# EAGLE design nrf24 leonardo prototype (EAGLE 7.1.0)
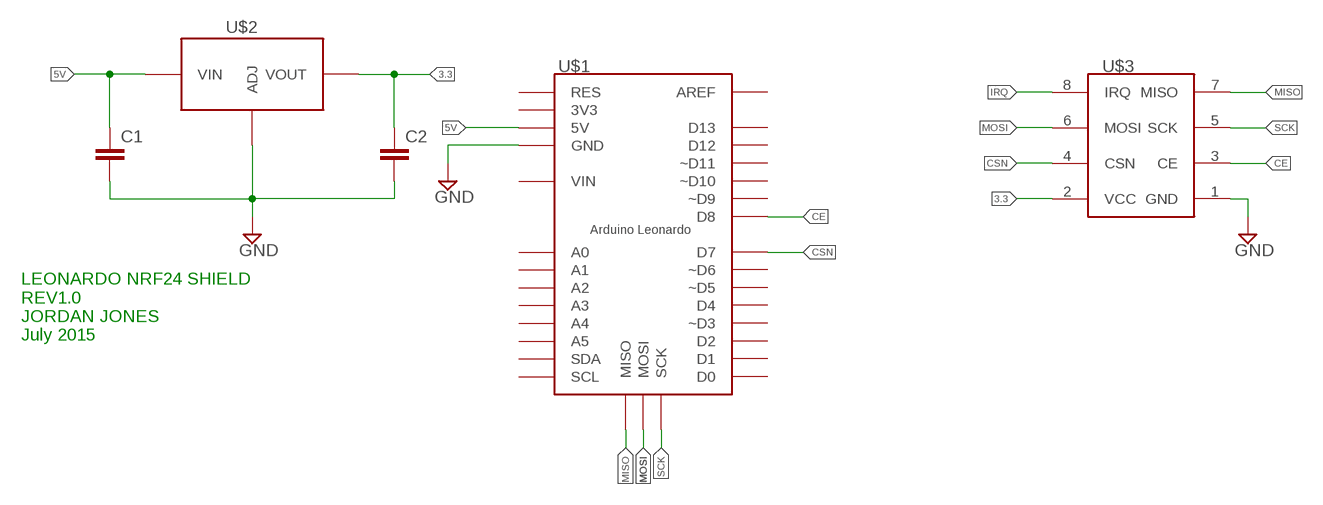
[diagram p0: schematic, sheet 1]

## Parts
C1  CAP0603-CAP  [0603-CAP]
C2  CAP0603-CAP  [0603-CAP]
U$1  LEONARDOSHIELDLEONARDO  [ARDUINOSHIELDR3ISP]
U$2  LM1117  [SOT223]
U$3  NRF24L01  [NRF24L01]

## Nets
3.3: C2.1 U$2.P2(VOUT) U$2.P4(VOUT) U$3.2(VCC)
5V: C1.1 U$1.5V1(5V) U$1.5V2(5V) U$2.P3(VIN)
CE: U$1.D8 U$3.3(CE)
CSN: U$1.D7 U$3.4(CSN)
GND: C1.2 C2.2 U$1.GND1(GND) U$1.GND2(GND) U$1.GND3(GND) U$1.GND4(GND) U$2.P1(ADJ) U$3.1(GND)
IRQ: U$3.8(IRQ)
MISO: U$1.MISO U$3.7(MISO)
MOSI: U$1.MOSI U$3.6(MOSI)
SCK: U$1.SCK U$3.5(SCK)
Unconnected: U$1.3.3V(3V3) U$1.A0 U$1.A1 U$1.A2 U$1.A3 U$1.A4 U$1.A5 U$1.AREF U$1.D0 U$1.D1 U$1.D2 U$1.D3(~D3) U$1.D4 U$1.D5(~D5) U$1.D6(~D6) U$1.D9(~D9) U$1.D10(~D10) U$1.D11(~D11) U$1.D12 U$1.D13 U$1.RES U$1.RES2(RES) U$1.SCL U$1.SDA U$1.VIN

## Notes on the sheet
- LEONARDO NRF24 SHIELD
  REV1.0
  JORDAN JONES
  July 2015

## Library data of the parts
C1 C2 = SparkFun-Capacitors:CAP: Capacitor Standard 0603 ceramic capacitor, and 0.1" leaded capacitor.
U$1 = Jordan Boards:LEONARDOSHIELD
U$2 = Jordan ICs:LM1117: LM1117 5vEd A linear voltage regulator set to 5volts. Max output is 800ma
U$3 = Jordan Boards:NRF24L01: REMEMBER THIS SHIT IS 3.3V MAX!

## Board
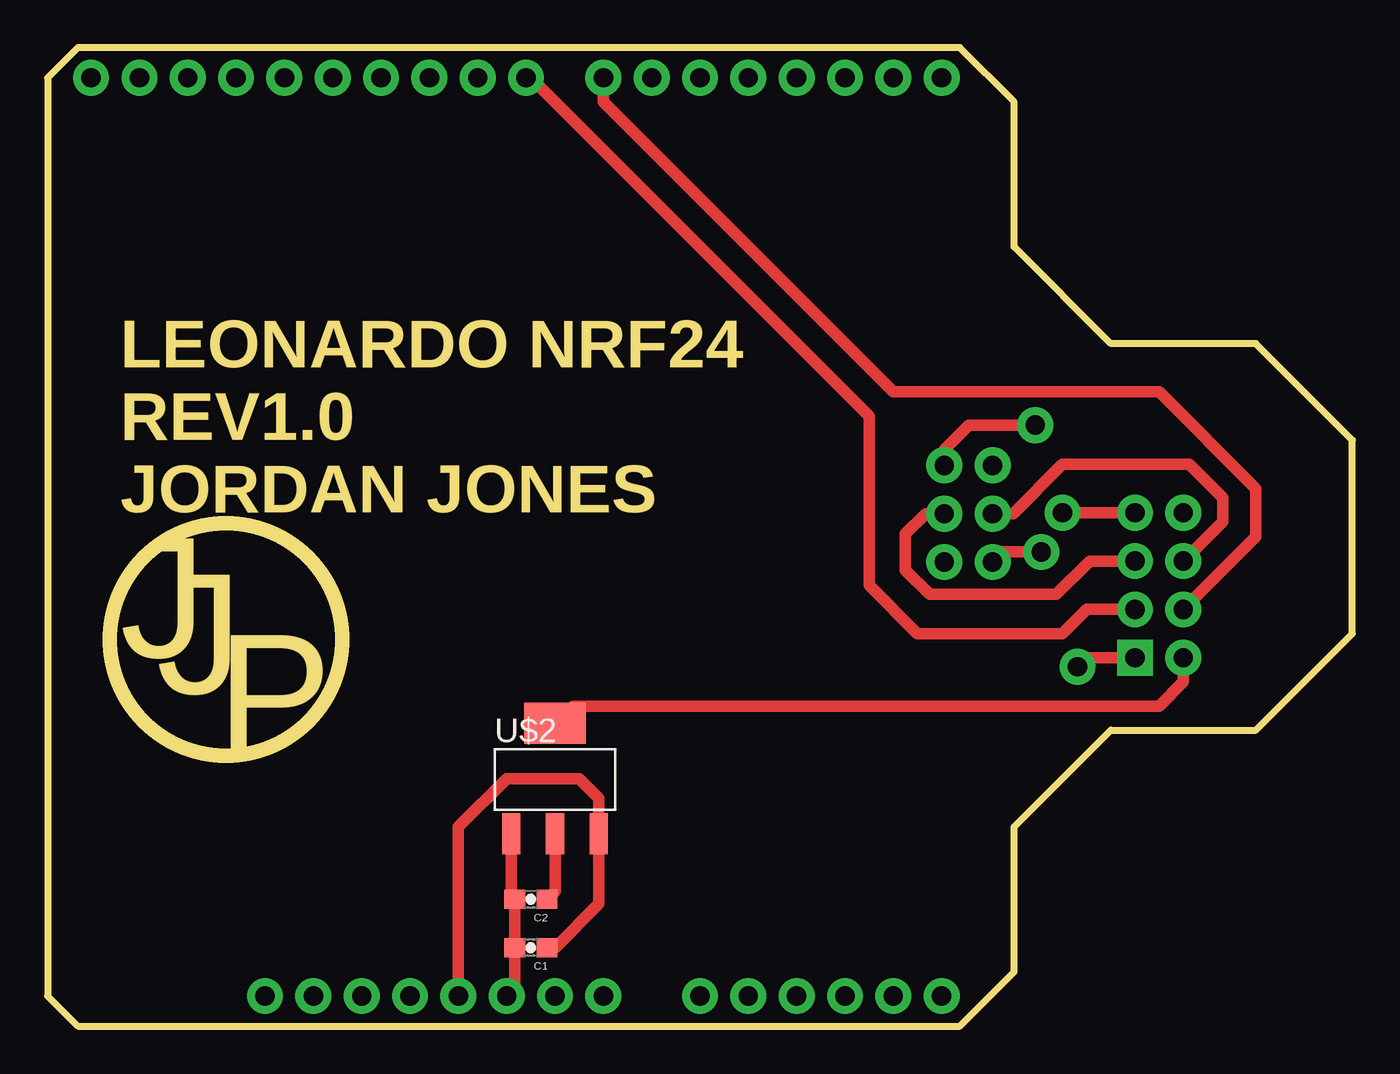
[diagram p1: board, top side]
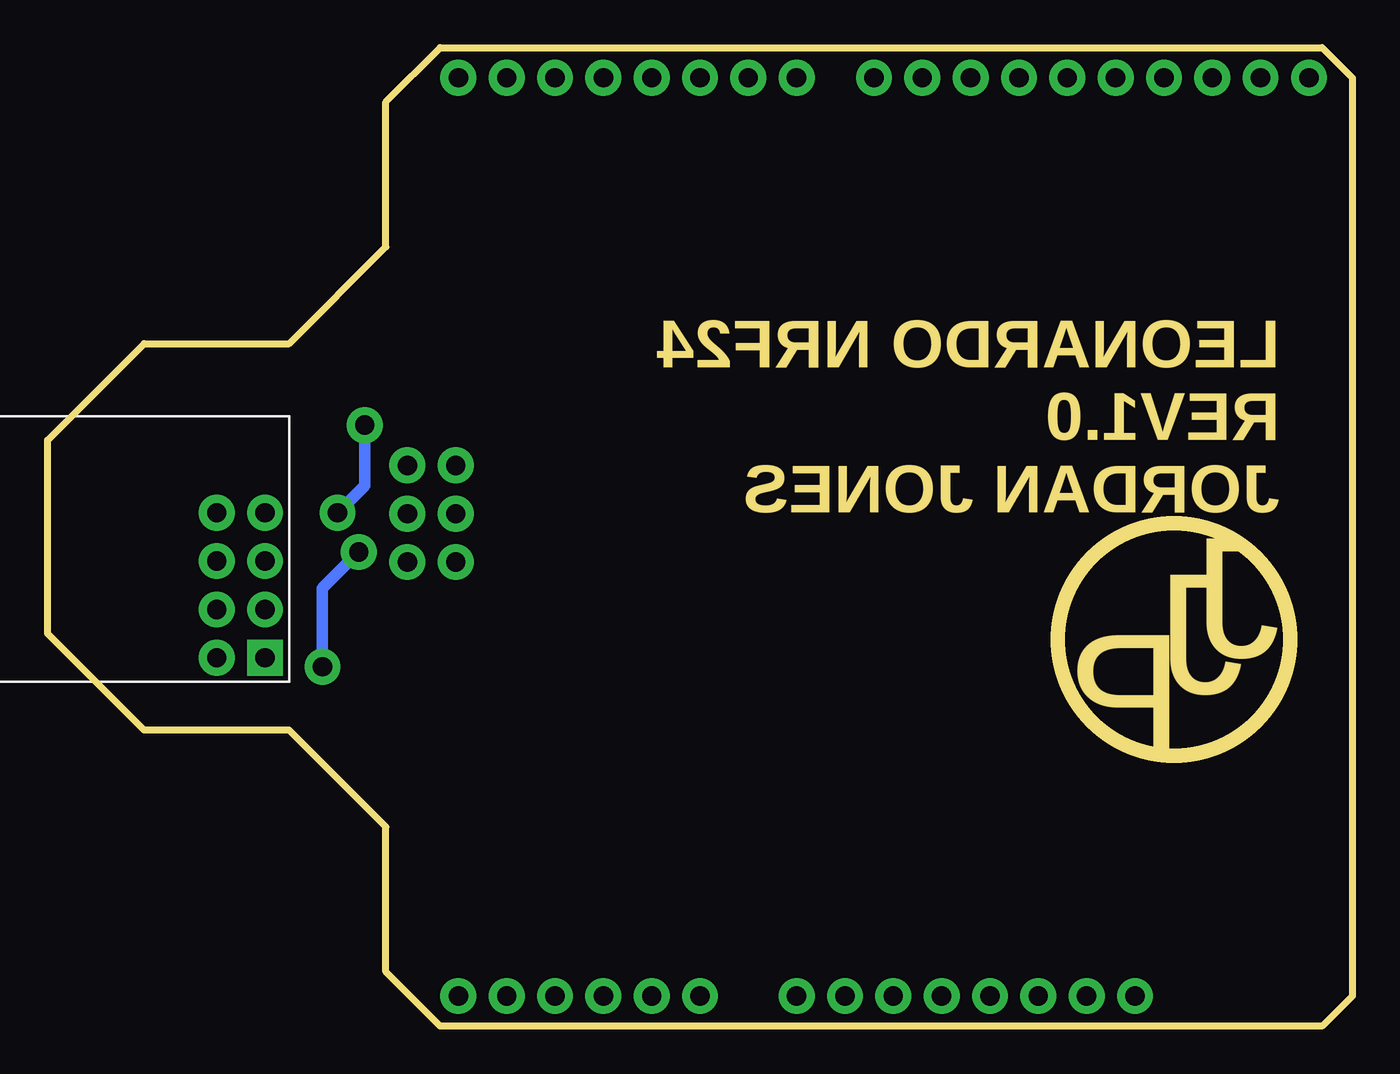
[diagram p2: board, bottom side, seen from below]

Size 68.58 x 51.44 mm. Coordinates in mm from the lower left corner, seen from the top.
Outline: 1.59,51.44 0,49.85 0,1.59 1.59,0 47.94,0 50.8,2.86 50.8,10.48 55.88,15.56 63.5,15.56 68.58,20.64 68.58,30.8 63.5,35.88 55.88,35.88 50.8,40.96 50.8,48.58 47.94,51.44 1.59,51.44
Outline: circle at 9.37,20.32 radius 6.1
Copper layers (1*16): Top 0.035mm / dielectric 1.5mm / Bottom 0.035mm
Design rules "default": minimum track width 10mil, minimum drill 24mil, track to track 8mil, track to pad 8mil, pad to pad 8mil, via to via 8mil, smd to smd 8mil, copper to edge 40mil, drill to drill 8mil, minimum pad ring 10mil, minimum via ring 8mil, stop-mask expansion 4mil, vias tented up to drill 0mil, thermal gap 10mil

### Footprints (pad centres in the part's own frame; a part is rotated, then mirrored left to right if it is on the bottom)
0603-CAP = smd 1.1 x 1: 1 -0.85,0; 2 0.85,0
ARDUINOSHIELDR3ISP = drill 1.016 pad 1.88: 3.3V 35.56,2.54; 5V1 38.1,2.54; 5V2 66.18,30.43; A0 50.8,2.54; A1 53.34,2.54; A2 55.88,2.54; A3 58.42,2.54; A4 60.96,2.54; A5 63.5,2.54; AREF 23.876,50.8; D0 63.5,50.8; D1 60.96,50.8; D2 58.42,50.8; D3 55.88,50.8; D4 53.34,50.8; D5 50.8,50.8; D6 48.26,50.8; D7 45.72,50.8; D8 41.656,50.8; D9 39.116,50.8; D10 36.576,50.8; D11 34.036,50.8; D12 31.496,50.8; D13 28.956,50.8; GND1 40.64,2.54; GND2 43.18,2.54; GND3 26.416,50.8; GND4 66.18,25.35; MISO 63.64,30.43; MOSI 66.18,27.89; P$1 30.48,2.54; P$2 27.94,2.54; RES 33.02,2.54; RES2 63.64,25.35; SCK 63.64,27.89; SCL 18.796,50.8; SDA 21.336,50.8; VIN 45.72,2.54
SOT223 = smd 0.95 x 2.15: P1 -2.3,-2.9; P2 0,-2.9; P3 2.3,-2.9 | smd 3.25 x 2.15: P4 0,2.9
NRF24L01 = drill 1.016 pad 1.88 square: 1 1.27,-1.27 | drill 1.016 pad 1.88: 2 -1.27,-1.27; 3 1.27,1.27; 4 -1.27,1.27; 5 1.27,3.81; 6 -1.27,3.81; 7 1.27,6.35; 8 -1.27,6.35

### Placement (x,y rotation side)
C1  25.4,4.13 180 top
C2  25.4,6.67 180 top
U$1  -16.51,-0.95 0 top
U$2  26.67,13.02 0 top
U$3  58.42,20.64 0 bottom

### Tracks (layer width: path | path; a pad name or v marks a point on that pad's centre or on a via)
3.3
  Top 0.61: U$2.P2 26.67,7.09 C2.1 | U$2.P4 26.71,15.92 27.62,16.83 58.42,16.83 59.69,18.1 U$3.2
5V
  Top 0.61: C1.1 26.67,4.13 28.97,6.43 U$2.P3 28.97,11.99 27.94,13.02 24.13,13.02 21.59,10.48 U$1.5V1
CE
  Top 0.61: U$1.D8 25.4,49.85 43.18,32.07 43.18,23.18 45.72,20.64 53.34,20.64 54.61,21.91 U$3.3
CSN
  Top 0.61: U$1.D7 29.21,48.58 44.45,33.34 58.42,33.34 63.5,28.26 63.5,25.72 U$3.4
GND  (via drill 1.02 pad 1.88)
  Top 0.61: U$1.GND1 24.55,2.01 C1.2 C2.2 24.37,6.85 U$2.P1 | U$3.1 54.61,19.37 v54.13,18.89 | v52.23,24.92 50.2,24.92 U$1.GND4
  Bottom 0.61: v54.13,18.89 54.13,23.02 v52.23,24.92
MISO  (via drill 1.02 pad 1.88)
  Top 0.61: U$1.MISO 47.13,30.3 48.42,31.59 v51.91,31.59 | v53.34,26.99 U$3.7
  Bottom 0.61: v51.91,31.59 51.91,28.42 v53.34,26.99
MOSI
  Top 0.61: U$1.MOSI 50.75,26.94 53.34,29.53 60.01,29.53 61.75,27.78 61.75,26.51 U$3.6
SCK
  Top 0.61: U$1.SCK 46.15,26.94 45.08,25.88 45.08,23.97 46.36,22.7 53.02,22.7 54.77,24.45 U$3.5

### Text on the board
Dimension: LEONARDO NRF24 | REV1.0 | JORDAN JONES | J | J | P